# EasyEDA Pro project ProPrj_Embedded Tools_2024-11-02.epro, schematic X-Link&OSBDM

## Sheets
1 Misc: Board Name: X-Link&OSBDM; Create Date: 2024-08-30; Page Name: Misc; Project Name: Embedded Tools; Schematic Name: X-Link&OSBDM; Update Date: 2024-11-01; Company: 嘉立创EDA; Page Size: A4; Version: V1.0
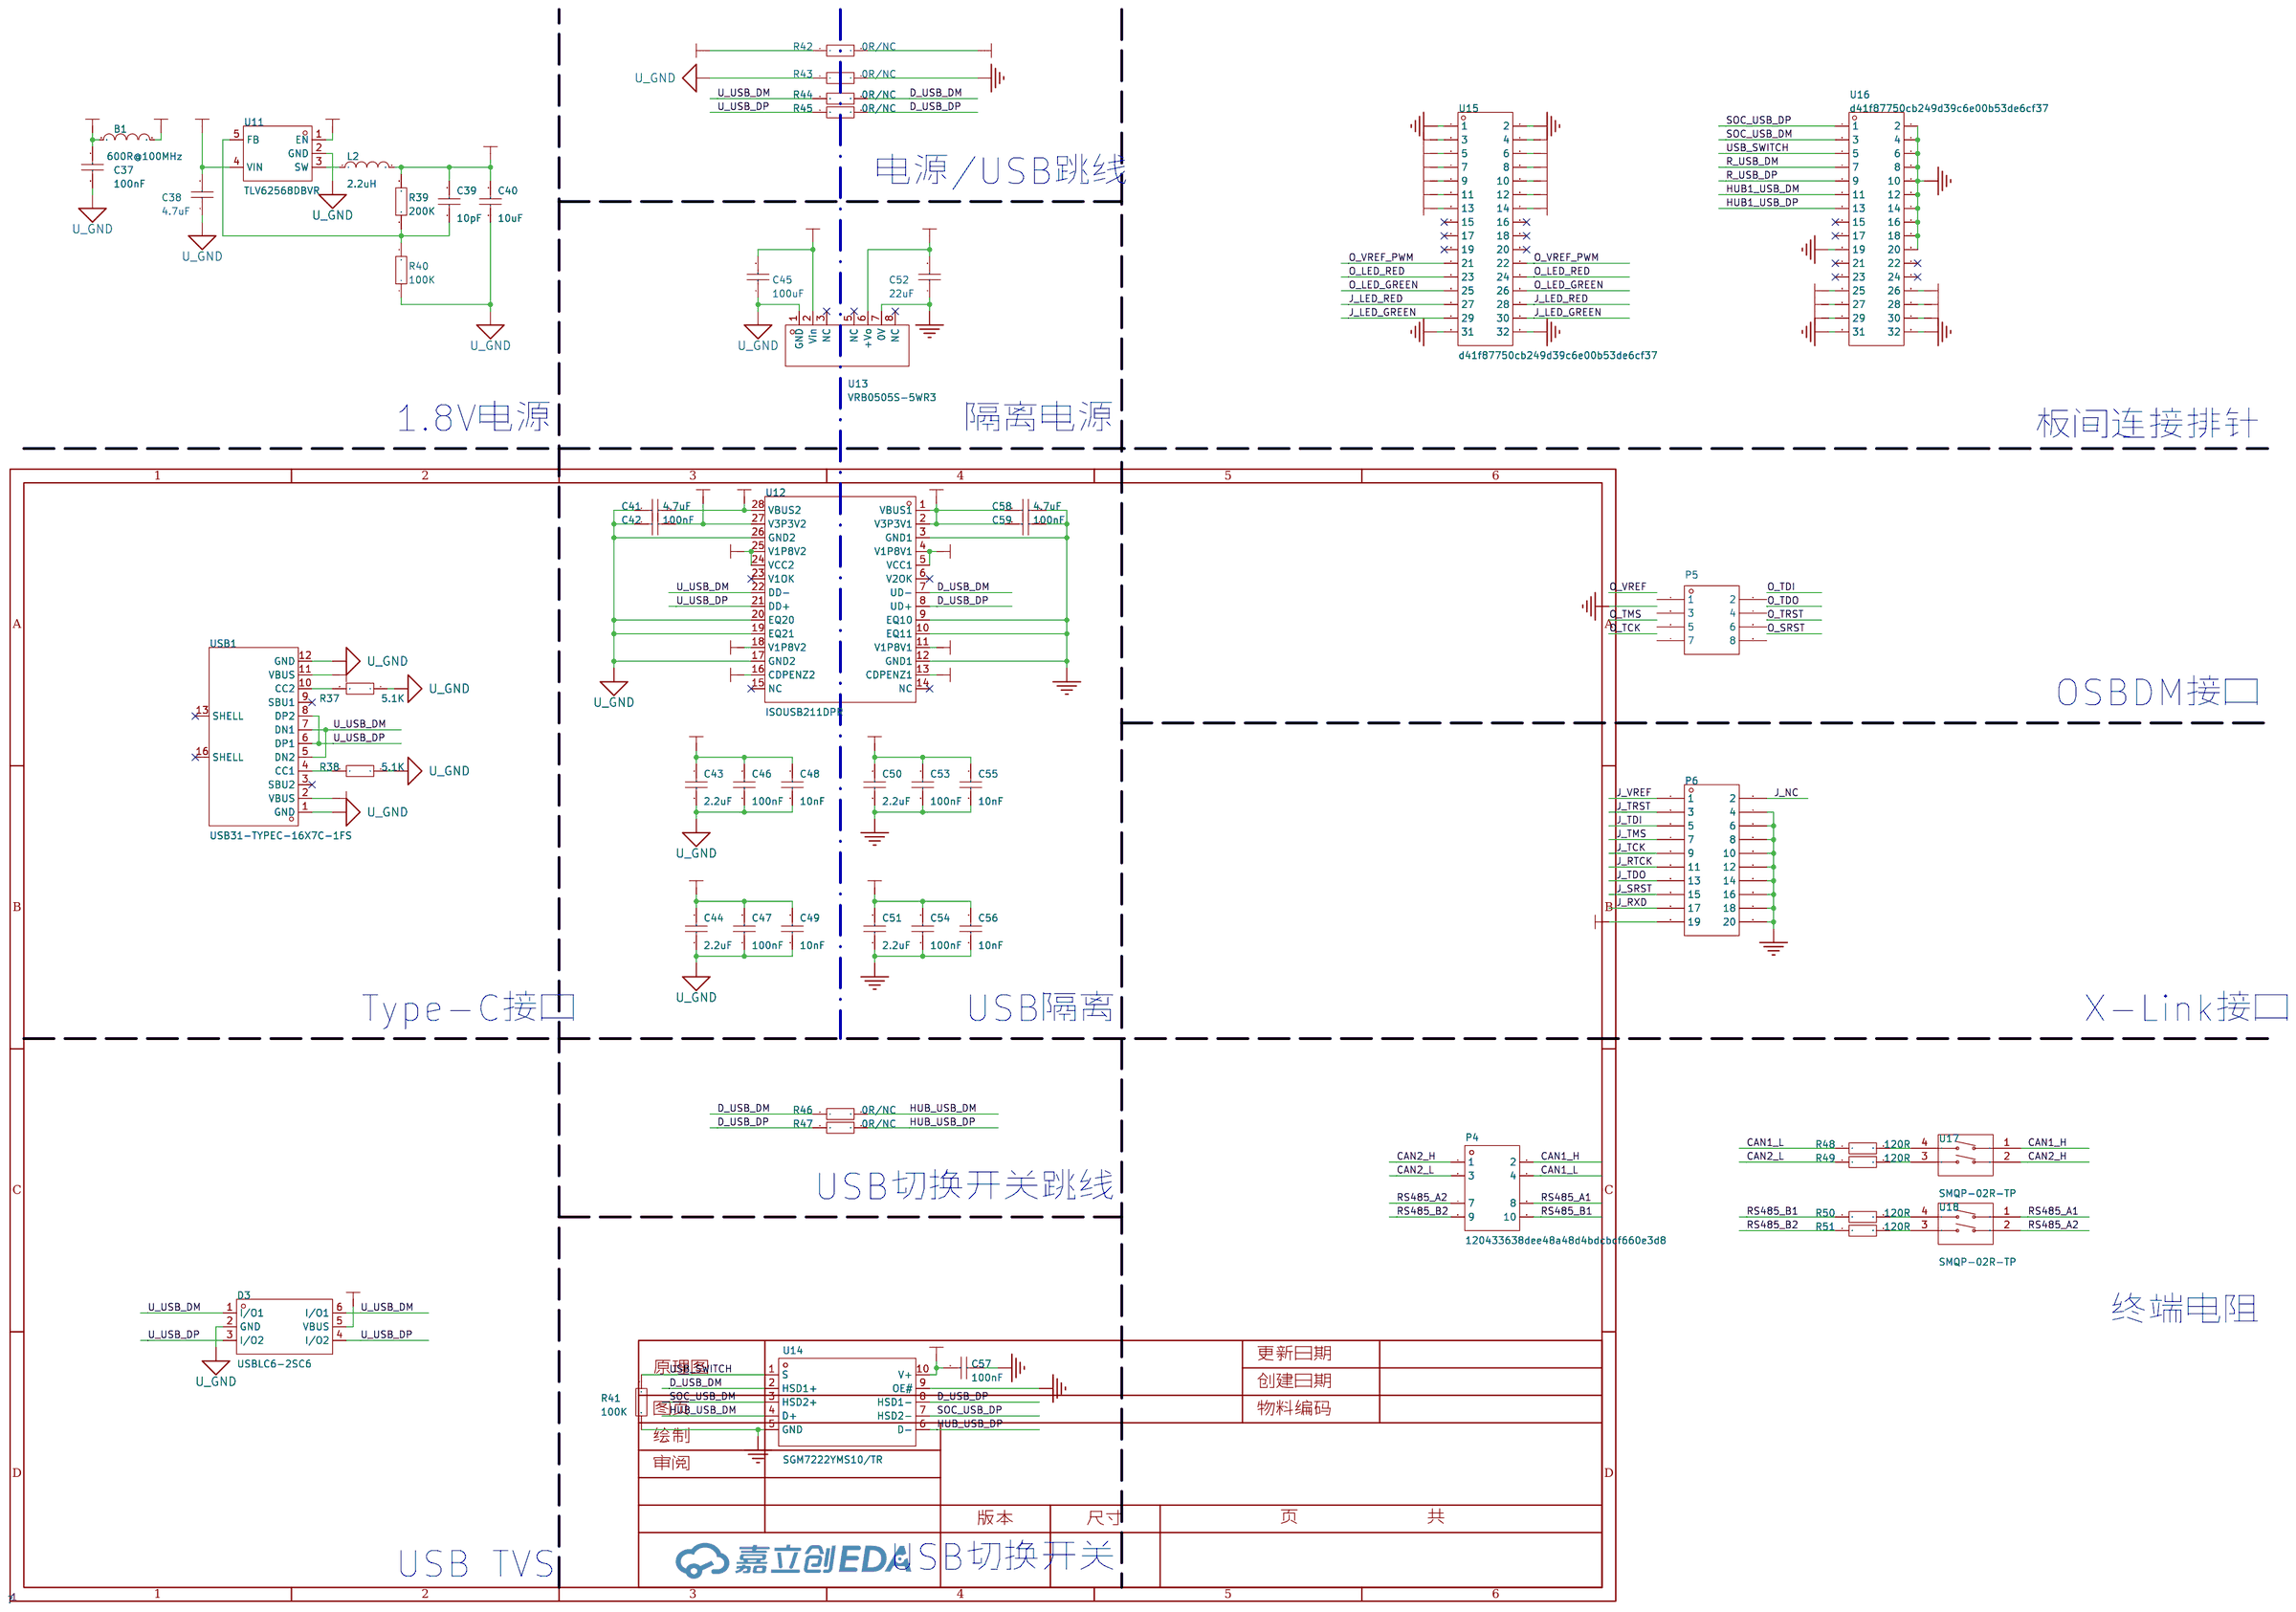
[diagram p5: Misc]
2 OSBDM: Create Date: 2024-09-08; Page Name: OSBDM; Update Date: 2024-10-13
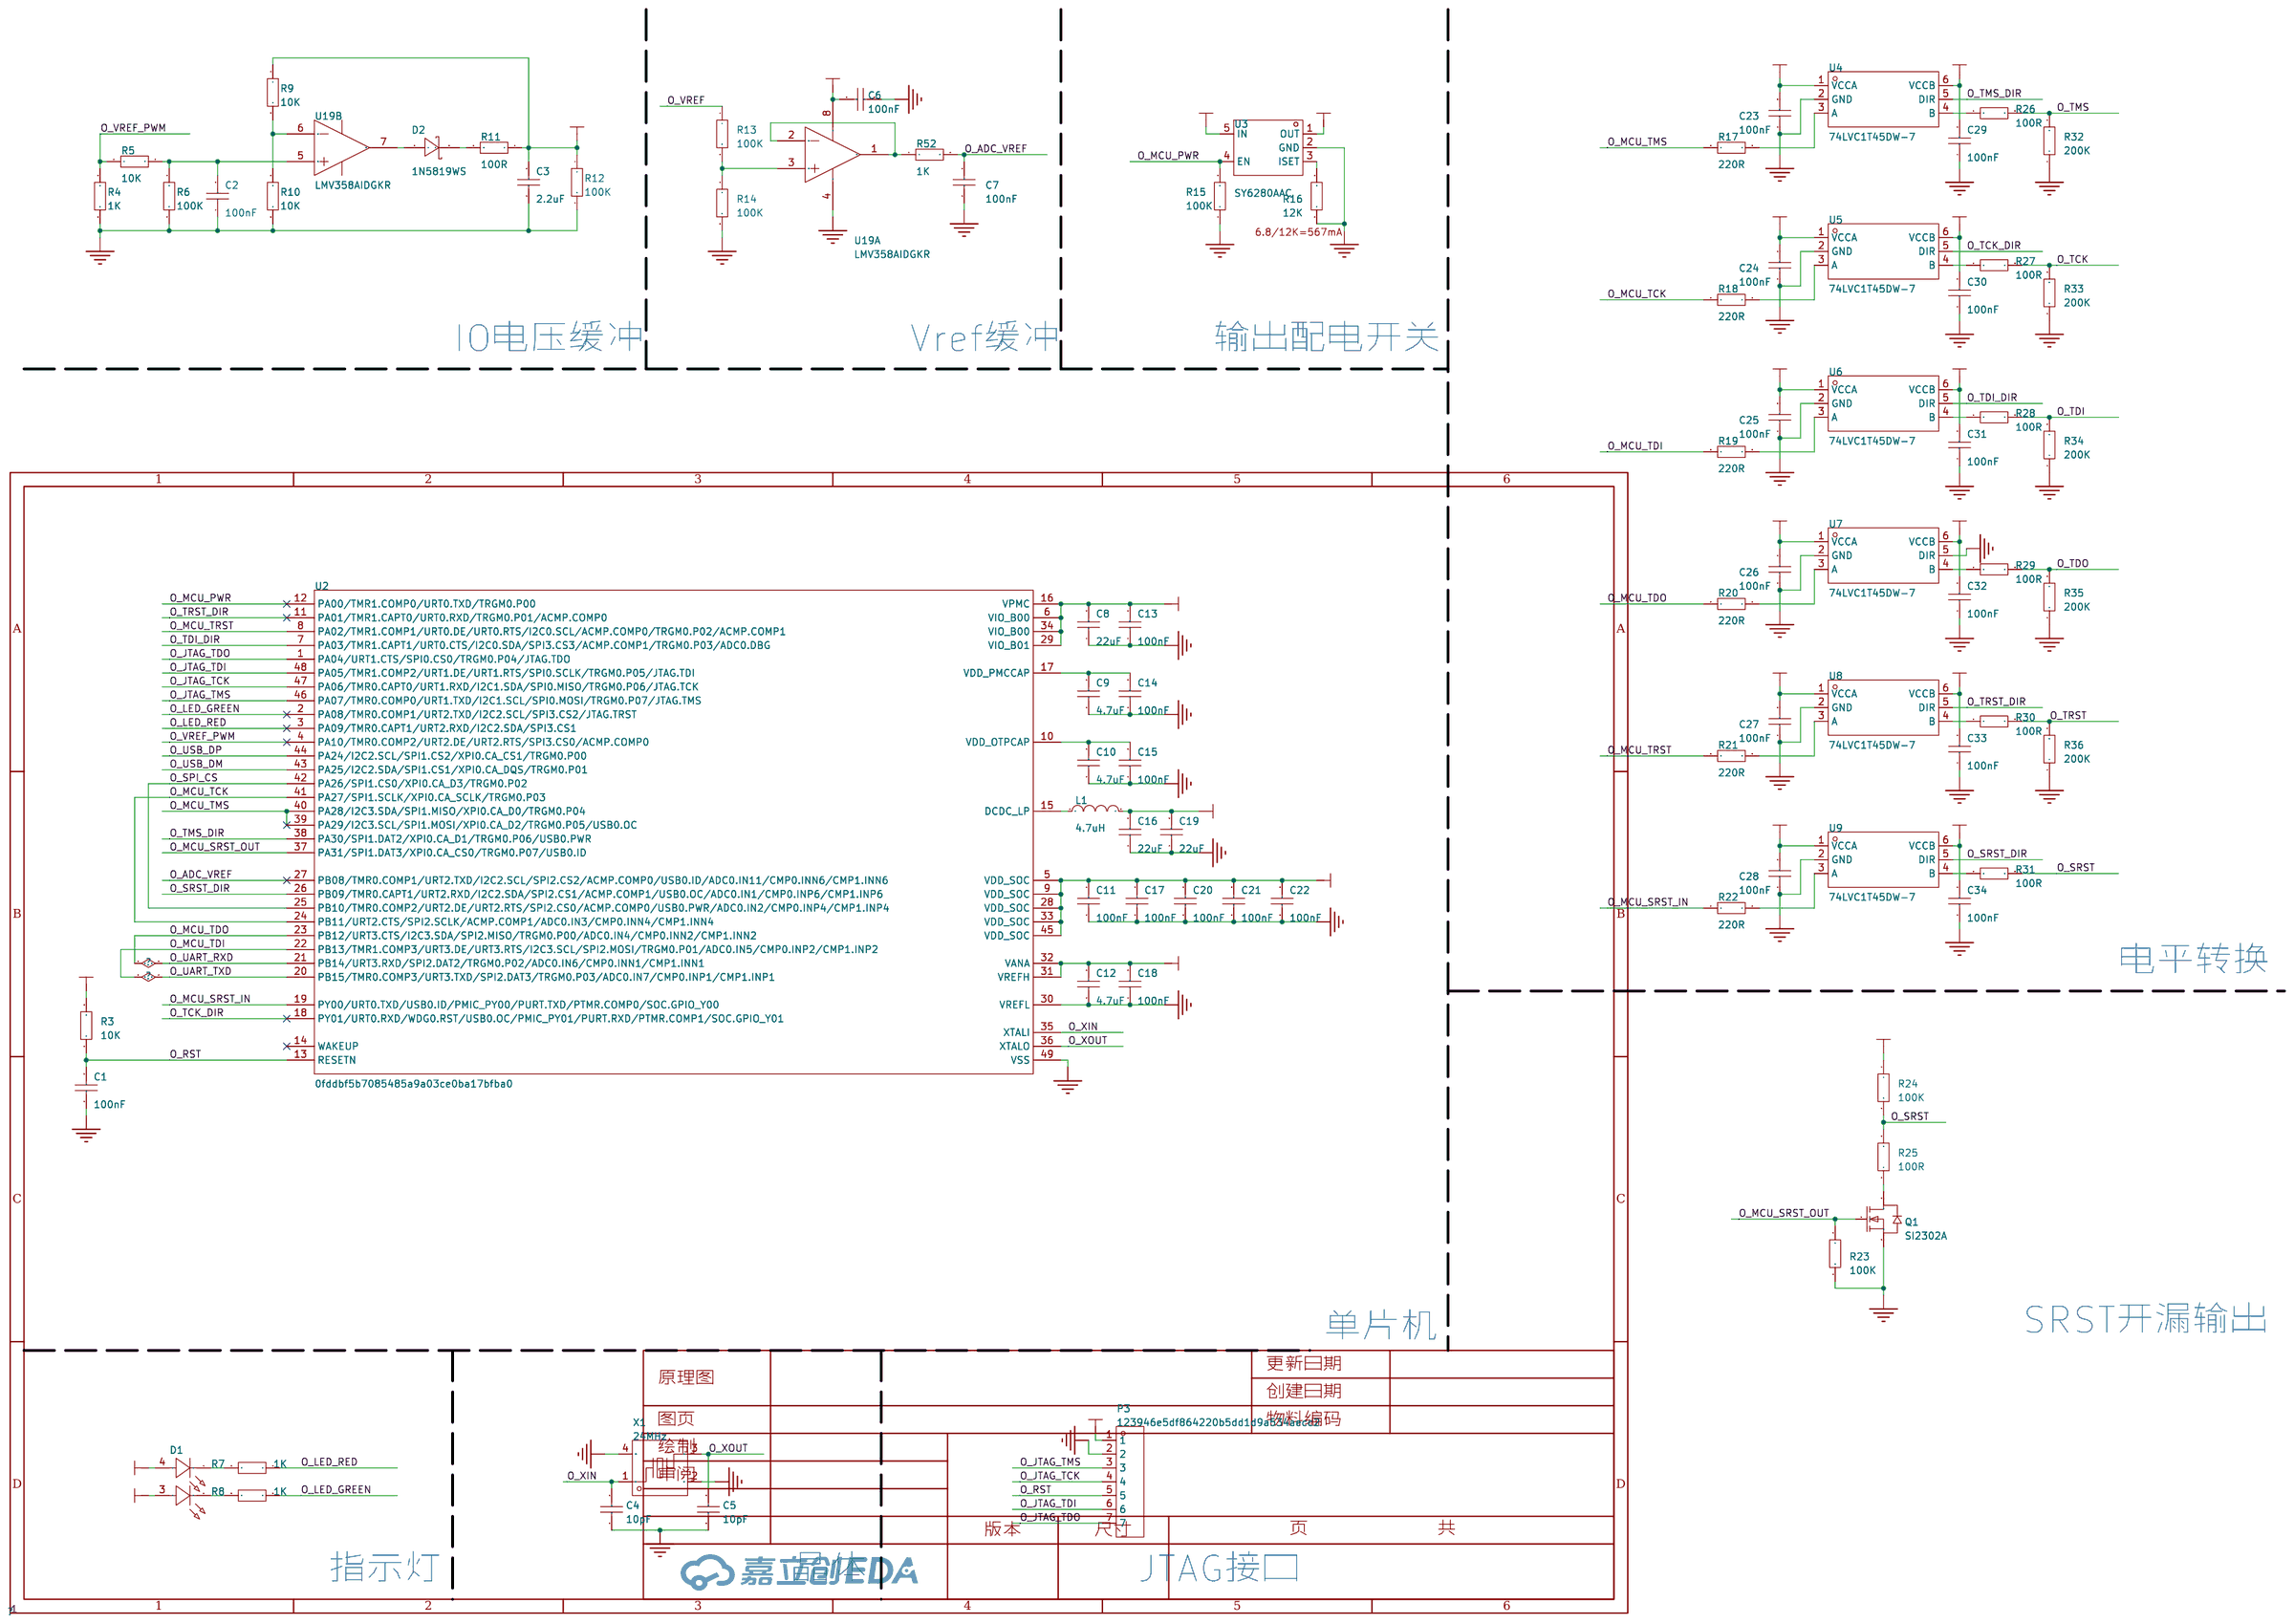
[diagram p6: OSBDM]
3 X-Link: Create Date: 2024-09-09; Page Name: X-Link; Update Date: 2024-10-02
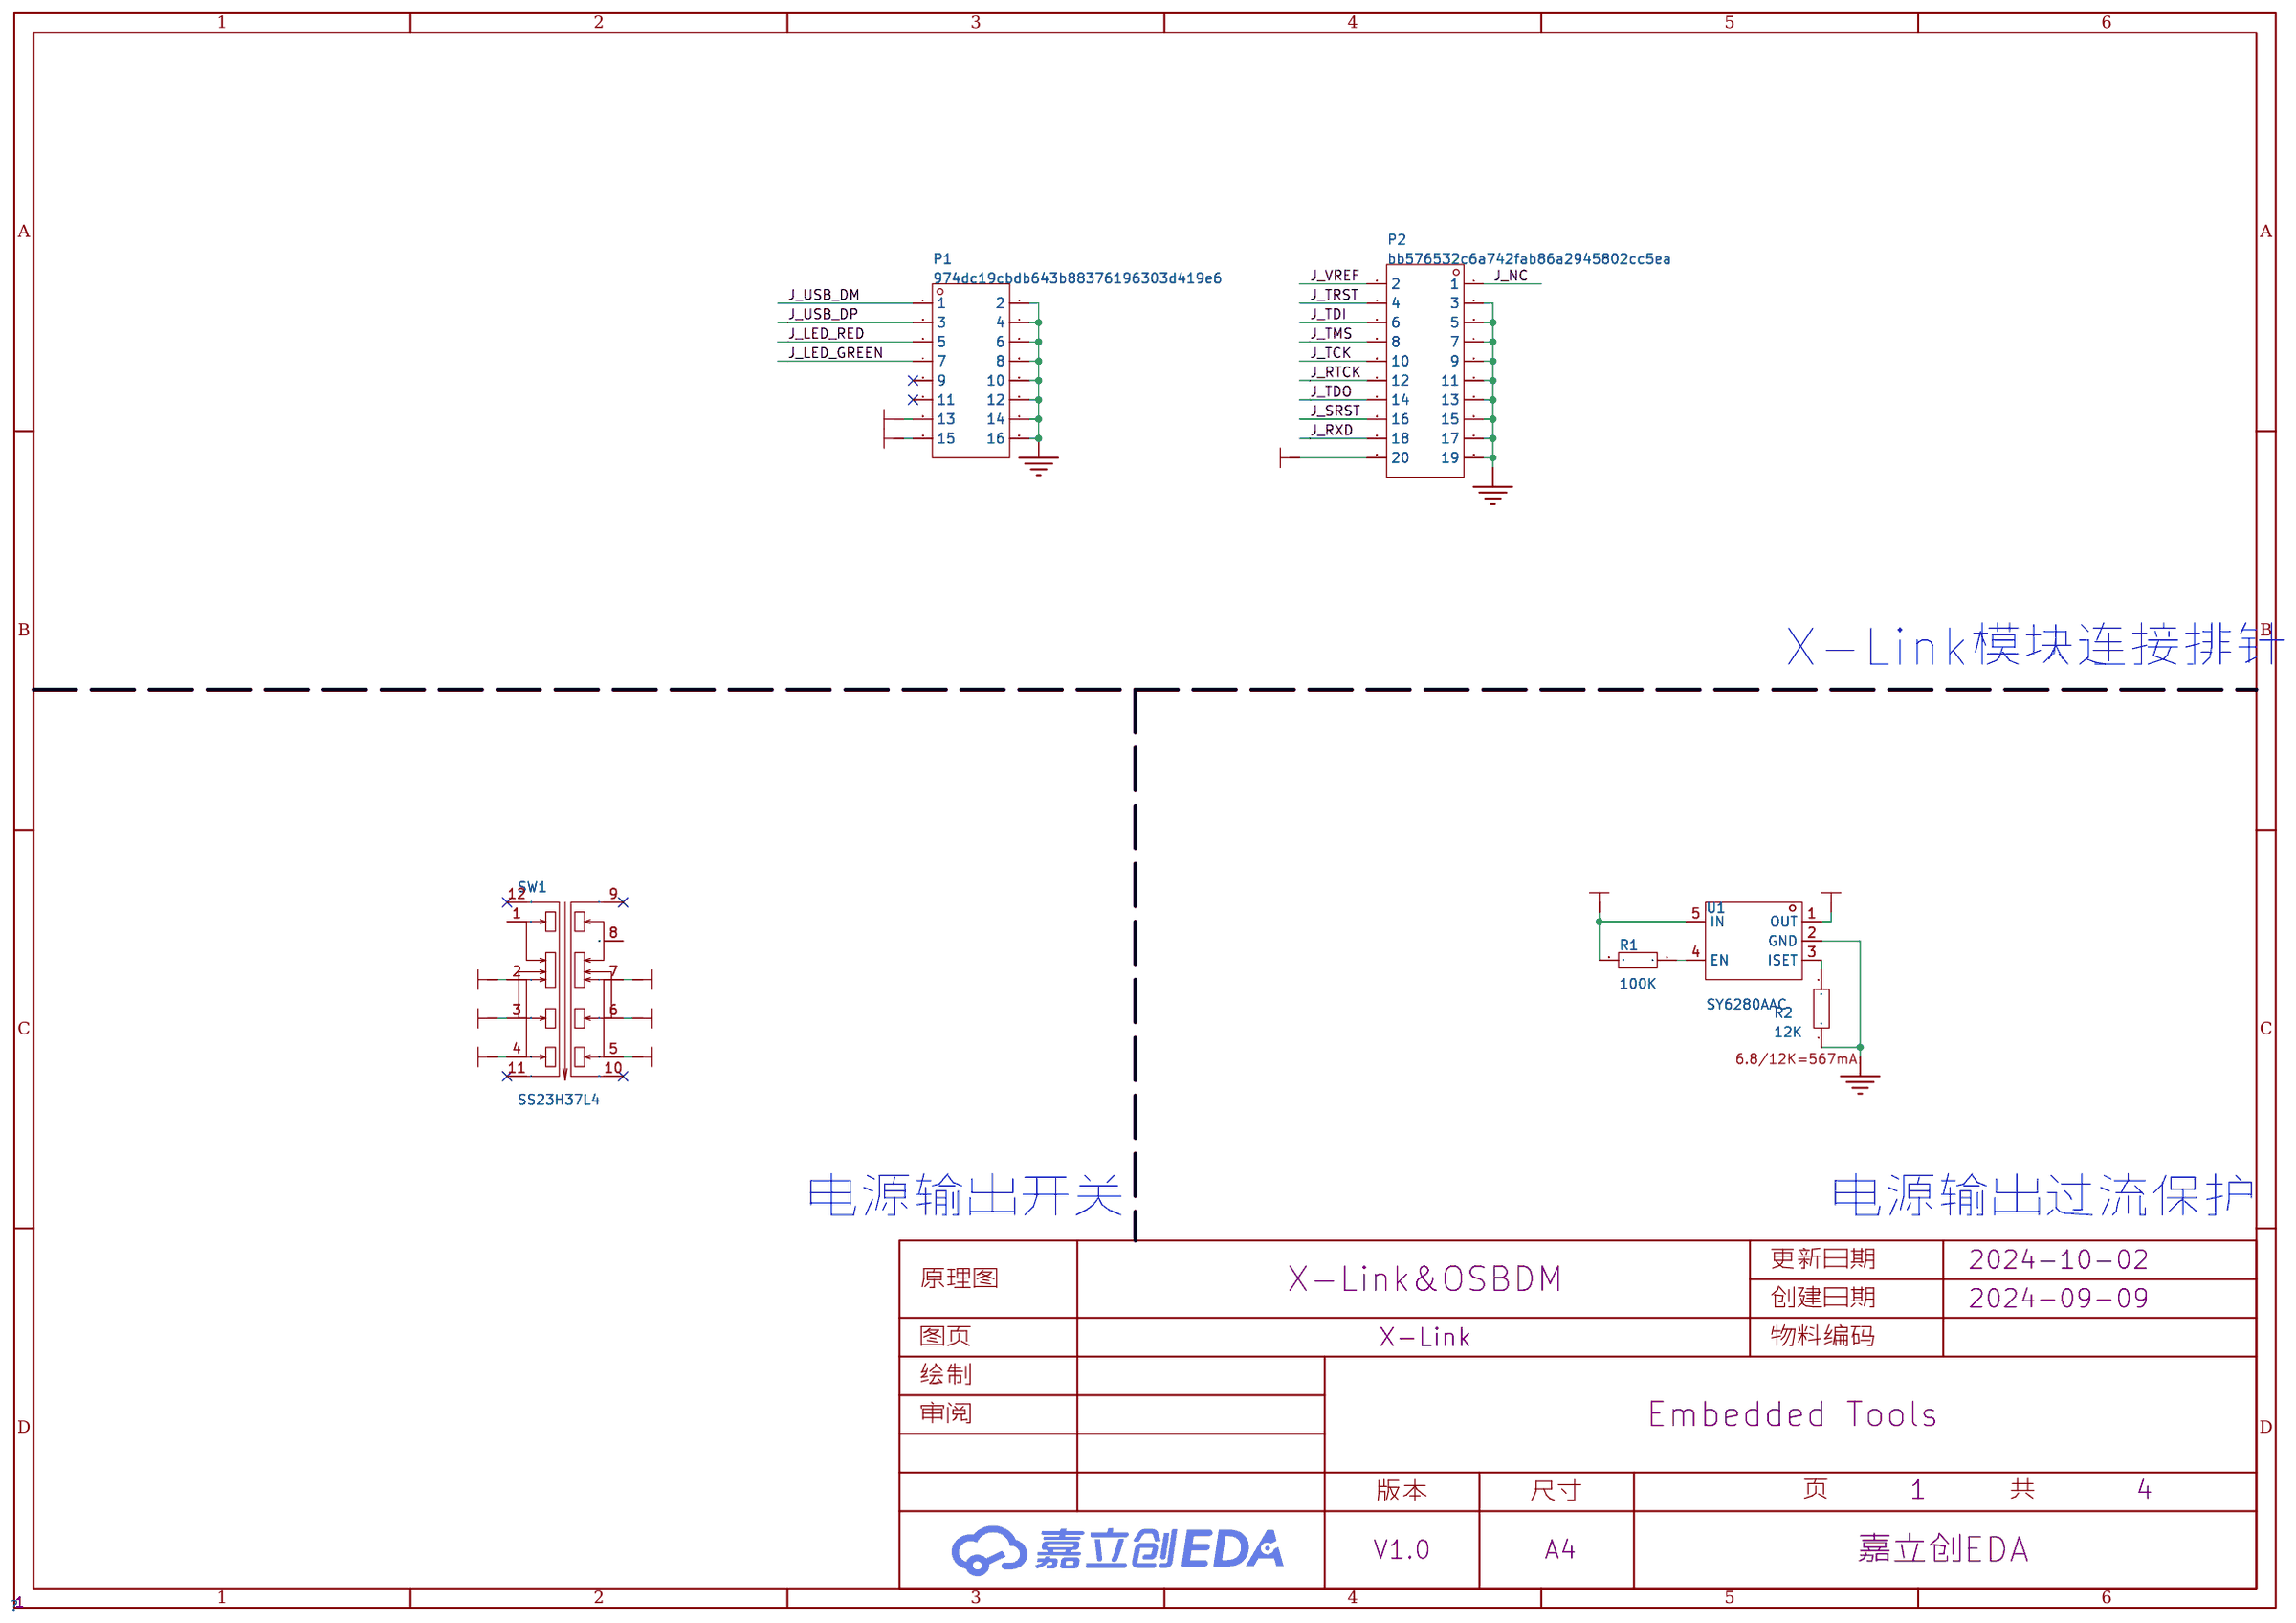
[diagram p7: X-Link]
4 USB_HUB: Create Date: 2024-09-16; Page Name: USB_HUB; Update Date: 2024-10-01
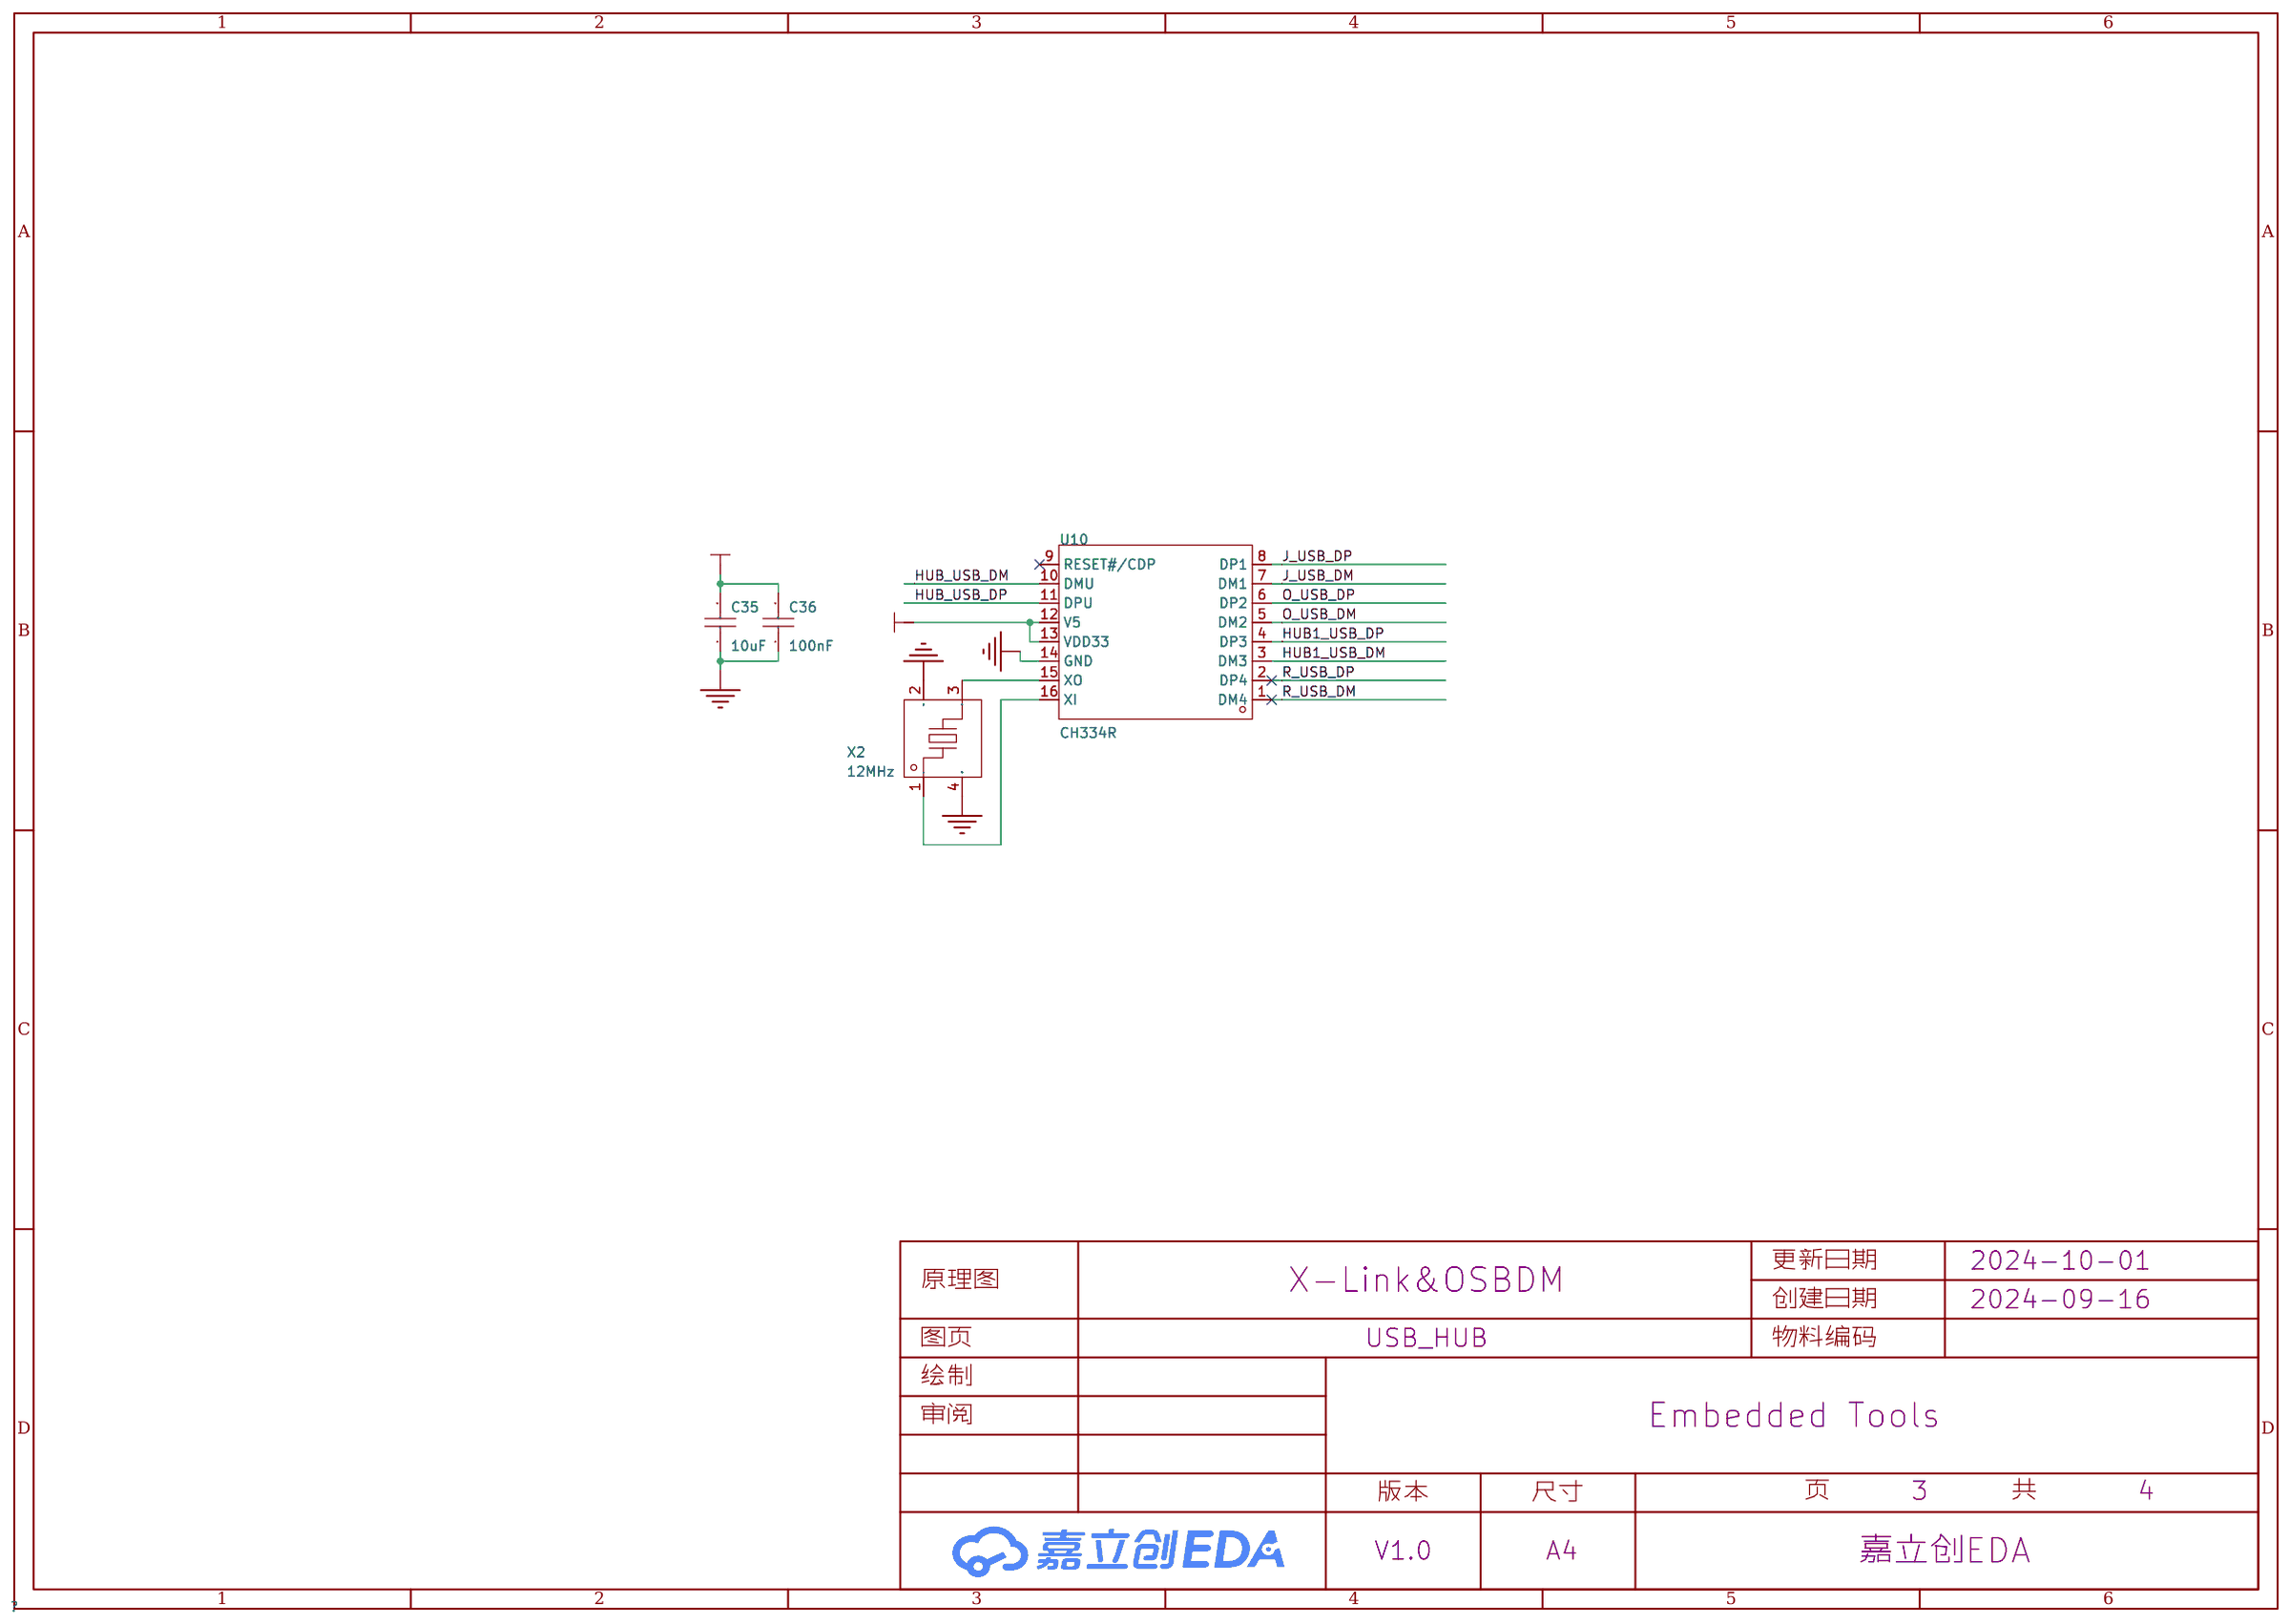
[diagram p8: USB_HUB]

## Parts
sheet Misc
B1  600R@100MHz  [L0603]
C37  100nF  [C0402]
C38  4.7uF  [C0402]
C39  10pF  [C0402]
C40  10uF  [C0402]
C41  4.7uF  [C0402]
C42  100nF  [C0402]
C43  2.2uF  [C0402]
C44  2.2uF  [C0402]
C45  100uF  [C1206]
C46  100nF  [C0402]
C47  100nF  [C0402]
C48  10nF  [C0402]
C49  10nF  [C0402]
C50  2.2uF  [C0402]
C51  2.2uF  [C0402]
C52  22uF  [C0603]
C53  100nF  [C0402]
C54  100nF  [C0402]
C55  10nF  [C0402]
C56  10nF  [C0402]
C57  100nF  [C0402]
C58  4.7uF  [C0402]
C59  100nF  [C0402]
D3  USBLC6-2SC6  [SOT-23-6_L2.9-W1.6-P0.95-LS2.8-BL]
L2  2.2uH  [IND-SMD_L2.5-W2.0_MHCHL2520]
P4  120433638dee48a48d4bdcbcf660e3d8  [HDR-TH_10P-P1.27-V-M-R2-C5-S1.27_1]
P5  -  [IDC-SMD_8P-P2.54]
P6  -  [IDC-SMD_20P-P2.54]
R37  5.1K  [R0402]
R38  5.1K  [R0402]
R39  200K  [R0402]
R40  100K  [R0402]
R41  100K  [R0402]
R42  0R/NC  [R1206]
R43  0R/NC  [R1206]
R44  0R/NC  [R1206]
R45  0R/NC  [R1206]
R46  0R/NC  [R0402]
R47  0R/NC  [R0402]
R48  120R  [R1206]
R49  120R  [R1206]
R50  120R  [R1206]
R51  120R  [R1206]
U11  TLV62568DBVR  [SOT-23-5_L3.0-W1.7-P0.95-LS2.8-BR]
U12  ISOUSB211DPR  [SSOP-28_L10.3-W7.5-P0.65-LS10.3-BL]
U13  VRB0505S-5WR3  [PWRM-TH_7P-L22.0-W9.5-P2.54_VRB0505S-5WR3_ST]
U14  SGM7222YMS10/TR  [MSOP-10_L3.0-W3.0-P0.50-LS5.0-BL]
U15  d41f87750cb249d39c6e00b53de6cf37  [HDR-TH_32P-P1.27-V-M-R2-C16-S1.27]
U16  d41f87750cb249d39c6e00b53de6cf37  [HDR-TH_32P-P1.27-V-M-R2-C16-S1.27]
U17  SMQP-02R-TP  [SW-TH_4P-P2.54_SMQP-02R-TP]
U18  SMQP-02R-TP  [SW-TH_4P-P2.54_SMQP-02R-TP]
USB1  USB31-TYPEC-16X7C-1FS  [USB-SMD_USB31-TYPEC-16X7C-1FS]
sheet OSBDM
C1  100nF  [C0402]
C2  100nF  [C0402]
C3  2.2uF  [C0402]
C4  10pF  [C0402]
C5  10pF  [C0402]
C6  100nF  [C0402]
C7  100nF  [C0402]
C8  22uF  [C0603]
C9  4.7uF  [C0402]
C10  4.7uF  [C0402]
C11  100nF  [C0402]
C12  4.7uF  [C0402]
C13  100nF  [C0402]
C14  100nF  [C0402]
C15  100nF  [C0402]
C16  22uF  [C0603]
C17  100nF  [C0402]
C18  100nF  [C0402]
C19  22uF  [C0603]
C20  100nF  [C0402]
C21  100nF  [C0402]
C22  100nF  [C0402]
C23  100nF  [C0402]
C24  100nF  [C0402]
C25  100nF  [C0402]
C26  100nF  [C0402]
C27  100nF  [C0402]
C28  100nF  [C0402]
C29  100nF  [C0402]
C30  100nF  [C0402]
C31  100nF  [C0402]
C32  100nF  [C0402]
C33  100nF  [C0402]
C34  100nF  [C0402]
D1  -  [LED1615]
D2  1N5819WS  [SOD-323_L1.8-W1.3-LS2.5-RD]
L1  4.7uH  [IND-SMD_L2.5-W2.0]
P3  123946e5df864220b5dd1d9a534aecc2  [HDR-TH_7P-P1.27-V-M-1]
Q1  SI2302A  [SOT-23-3_L2.9-W1.3-P1.90-LS2.4-BR]
R3  10K  [R0402]
R4  1K  [R0402]
R5  10K  [R0402]
R6  100K  [R0402]
R7  1K  [R0402]
R8  1K  [R0402]
R9  10K  [R0402]
R10  10K  [R0402]
R11  100R  [R0402]
R12  100K  [R0402]
R13  100K  [R0402]
R14  100K  [R0402]
R15  100K  [R0402]
R16  12K  [R0402]
R17  220R  [R0402]
R18  220R  [R0402]
R19  220R  [R0402]
R20  220R  [R0402]
R21  220R  [R0402]
R22  220R  [R0402]
R23  100K  [R0402]
R24  100K  [R0402]
R25  100R  [R0402]
R26  100R  [R0402]
R27  100R  [R0402]
R28  100R  [R0402]
R29  100R  [R0402]
R30  100R  [R0402]
R31  100R  [R0402]
R32  200K  [R0402]
R33  200K  [R0402]
R34  200K  [R0402]
R35  200K  [R0402]
R36  200K  [R0402]
R52  1K  [R0402]
U2  0fddbf5b7085485a9a03ce0ba17bfba0  [QFN-48_L6.0-W6.0-P0.4-BL-EP4.2]
U3  SY6280AAC  [SOT-23-5_L3.0-W1.7-P0.95-LS2.8-BL]
U4  74LVC1T45DW-7  [SC-70-6_L2.2-W1.3-P0.65-LS2.1-BR]
U5  74LVC1T45DW-7  [SC-70-6_L2.2-W1.3-P0.65-LS2.1-BR]
U6  74LVC1T45DW-7  [SC-70-6_L2.2-W1.3-P0.65-LS2.1-BR]
U7  74LVC1T45DW-7  [SC-70-6_L2.2-W1.3-P0.65-LS2.1-BR]
U8  74LVC1T45DW-7  [SC-70-6_L2.2-W1.3-P0.65-LS2.1-BR]
U9  74LVC1T45DW-7  [SC-70-6_L2.2-W1.3-P0.65-LS2.1-BR]
U19  LMV358AIDGKR  [VSSOP-8_L3.0-W3.0-P0.65-LS5.0-BL]  (sections 1,2)
X1  24MHz  [CRYSTAL-SMD_4P-L2.0-W1.6-BL-A]
sheet USB_HUB
C35  10uF  [C0402]
C36  100nF  [C0402]
U10  CH334R  [QSOP-16_L4.9-W3.9-P0.64-LS6.0-BL]
X2  12MHz  [CRYSTAL-SMD_4P-L2.5-W2.0-BL-A]
sheet X-Link
P1  974dc19cbdb643b88376196303d419e6  [HDR-SMD_16P-P1.27-V-M-R2-C8-LS5.5]
P2  bb576532c6a742fab86a2945802cc5ea  [HDR-SMD_20P-P1.27-V-M-R2-C10-LS5.5]
R1  100K  [R0402]
R2  12K  [R0402]
SW1  SS23H37L4  [SW-TH_SS23H37LX_SMD]
U1  SY6280AAC  [SOT-23-5_L3.0-W1.7-P0.95-LS2.8-BL]

## Library data of the parts
B1 = B0603
C1-C7 C9-C15 C17 C18 C20-C44 C46-C51 C53-C59 = C0402
C45 = C1206
C8 C16 C19 C52 = C0603
D3 = USBLC6-2SC6: 最大钳位电压:15V;击穿电压:6V;; Supplier Part: C2687116; Manufacturer: UMW(友台半导体); Supplier Footprint: SOT-23-6; JLCPCB Part Class: 扩展库; Datasheet: https://atta.szlcsc.com/upload/public/pdf/source/20231109/512642D850D9873E7C519F71E85B9A10.pdf; Supplier: LCSC; Maximum Clamping Voltage: 15V; Breakdown Voltage: 6V; Number of Lines: 双路; Type: ESD
L2 = FTC252012S2R2MBCA: 电感值:2.2uH;精度:±20%;额定电流:3A;饱和电流(Isat):3.8A;类型:一体成型电感;; LCSC Part Name: 2.2uH ±20% 3.8A; Supplier Part: C5832372; Manufacturer: cjiang(长江微电); Supplier Footprint: 1008; JLCPCB Part Class: 扩展库; Datasheet: https://atta.szlcsc.com/upload/public/pdf/source/20230602/8FFEDA9C0247A92A0D4B67554BFE4091.pdf; Supplier: LCSC; Tolerance: ±20%; Rated Current: 3A; Saturation Current (Isat): 3.8A; DC Resistance (DCR): 55mΩ; Type: 一体成型电感
P4 = HDR2x5_1.27_1: Pin Structure: 2x5P; Pitch: 1.27mm; Row Spacing: 1.27mm; Circluar Pins/Square Pins: 方针; Mounting Type: 直插; Number of Rows: 双排; Number of Pins: 5P; Current Rating (Max): 1A; Voltage Rating (Max): 500V; Length of Mating Pin: 3.9mm; Insulation Height: 1mm; Length of End Connection Pin: 2.3mm; Contact Material: 黄铜; Contact Plating: 金; Operating Temperature Range: -40℃~+105℃; Color: 黑色
P5 = IDC2x4_SMD: LCSC Part Name: 2.54mm 2x4P 直插; Supplier Footprint: 插件,P=2.54mm; Pitch: 2.54mm; Number of Pins: 8; Number of Rows: 2; Pin Structure: 2x4P; Row Spacing: 2.54mm; Mounting Type: 直插; Length of Mating Pin: 6mm; Insulation Height: 2.54mm; Length of End Connection Pin: 3mm; Contact Material: 黄铜; Operating Temperature Range: -40℃~+105℃; Color: 黑色
P6 = IDC2x10_SMD: LCSC Part Name: 2.54mm 2x10P 直插; Supplier Footprint: 插件,P=2.54mm; JLCPCB Part Class: 扩展库; Pitch: 2.54mm; Number of Pins: 20; Number of Rows: 2; Pin Structure: 2x10P; Row Spacing: 2.54mm; Mounting Type: 直插; Length of Mating Pin: 6mm; Insulation Height: 2.54mm; Length of End Connection Pin: 3mm; Contact Material: 黄铜; Operating Temperature Range: -40℃~+105℃; Color: 黑色
R1-R41 R46 R47 R52 = R0402
R42-R45 R48-R51 = R1206: Tolerance: ±1%; Power(Watts): 250mW; Overload Voltage (Max): 200V
U11 = TLV62568DBVR: 功能类型:降压型;输出类型:可调;输入电压:2.5V~5.5V;输出电压:600mV~5.5V;输出电流(最大值):1A;; Supplier Part: C163219; Manufacturer: TI(德州仪器); Supplier Footprint: SOT-23-5; JLCPCB Part Class: 扩展库; Datasheet: https://www.ti.com/cn/lit/gpn/tlv62568; Supplier: LCSC; Function: 降压型; Output Type: 可调; Input Voltage: 2.5V~5.5V; Output Voltage: 600mV~5.5V; Output Current (Max): 1A; Switching Frequency: 1.5MHz; Operating Temperature: -40℃~+125℃@(TJ); Synchronous Rectification: 是; Number of Outputs: 1; Topology: 降压式; Switch tube (built-in/external): 内置
U12 = ISOUSB211DPR: ISOUSB211 支持低速、高速和全速的低发射隔离式 USB 中继器; Supplier Part: C5772877; Manufacturer: TI(德州仪器); Supplier Footprint: BSSOP-28-300mil; JLCPCB Part Class: 扩展库; Datasheet: https://atta.szlcsc.com/upload/public/pdf/source/20230925/C201D485FB1E1EBF3CEDEE9AEF66BD61.pdf; Supplier: LCSC
U13 = VRB0505S-5WR3_ST: Supplier Part: C5189717; Manufacturer: MORNSUN(金升阳); Supplier Footprint: SIP-7; Datasheet: https://atta.szlcsc.com/upload/public/pdf/source/20230425/EEAB300A3CA35F3087473504672B5381.pdf; Supplier: LCSC
U14 = SGM7222YMS10/TR: 开关电路:-;多路复用器/解复用器电路:-;导通电阻（最大值）:-;开关电压（最大值）:-;; Supplier Part: C113292; Manufacturer: SGMICRO(圣邦微); Supplier Footprint: MSOP-10; JLCPCB Part Class: Extended Part; Datasheet: https://atta.szlcsc.com/upload/public/pdf/source/20170712/C113292_1499832269144814226.pdf; Supplier: LCSC
U15 U16 = HDR2x16_1.27: Datasheet: https://atta.szlcsc.com/upload/public/pdf/source/20230512/C02704E0D5277BE7490B80240C3912B9.pdf; Pin Structure: 2x16P; Pitch: 1.27mm; Row Spacing: 1.27mm; Circluar Pins/Square Pins: 方针; Mounting Type: 直插; Number of Rows: 双排; Number of Pins: 32P; Current Rating (Max): 1A; Voltage Rating (Max): 250V; Length of Mating Pin: 4mm; Insulation Height: 1mm; Length of End Connection Pin: 2.3mm; Contact Material: 黄铜; Contact Plating: 金; Operating Temperature Range: -40℃~+105℃; Soldering Temperature(Max): 260℃; Color: 黑色
U17 U18 = SMQP-02R-TP: 类型:琴键;电路结构:-;开关位数:2位;额定电流:-;额定电压:-;使用寿命:5千次;颜色:红色;; LCSC Part Name: 间距2.54mm 琴键2位拨码开关; Supplier Part: C5299482; Manufacturer: SM Switch; JLCPCB Part Class: 扩展库; Datasheet: https://atta.szlcsc.com/upload/public/pdf/source/20230428/70B55ED7BA6FDEB5D2D5B22165FF4512.pdf; Supplier: LCSC; Type: 琴键; Number of Positions: 2位; Lead Pitch: 2.54mm; Operating Temperature: -40℃~+85℃; Operating Life: 5千次; Color: 红色
USB1 = USB31-TYPEC-16X7C-1FS: 连接器类型:Type-C;标准:USB 3.1;公母:母;安装方式:沉板;触点数量:24P;端口数量:1;额定电流 - 电源:3A;触头材质:磷青铜;触头镀层:金;工作温度范围:-25℃~+80℃;焊接温度(最大值):260℃;; LCSC Part Name: Type-C 母 沉板 两件套; Supplier Part: C2880667; Manufacturer: XKB Connection(中国星坤); Supplier Footprint: SMD; JLCPCB Part Class: 扩展库; Datasheet: https://atta.szlcsc.com/upload/public/pdf/source/20211011/8558E12E1491007827A313C13D78E73E.pdf; Supplier: LCSC; Connector Type: Type-C; Standard: USB 3.1; Gender: 母; Mounting Style: 沉板; Number of Contacts: 24P; Number of Ports: 1; Current Rating - Power (Max): 3A; Contact Material: 磷青铜; Contact Plating: 金; Operating Temperature Range: -25℃~+80℃; Soldering Temperature(Max): 260℃
D1 = LED1615
D2 = 1N5819WS_C191023: 直流反向耐压(Vr):40V;平均整流电流(Io):1A;正向压降(Vf):600mV@1A;; LCSC Part Name: 40V 1A 600mV@1A; Supplier Part: C191023; Manufacturer: Hottech(合科泰); Supplier Footprint: SOD-323; JLCPCB Part Class: 基础库; Datasheet: https://atta.szlcsc.com/upload/public/pdf/source/20220428/3CB86FD8D28D653594B4E35F9D5AEFD9.pdf; Supplier: LCSC; Reverse Voltage (Vr): 40V; Average Rectified Current (Io): 1A; Forward Voltage (Vf@If): 600mV@1A
L1 = SWPA252012S4R7MT: 电感值:4.7uH;精度:±20%;额定电流:840mA;饱和电流(Isat):1.25A;类型:-;; LCSC Part Name: 4.7uH ±20% 1.25A; Supplier Part: C87640; Manufacturer: Sunlord(顺络); Supplier Footprint: 1008; JLCPCB Part Class: 扩展库; Datasheet: https://atta.szlcsc.com/upload/public/pdf/source/20231024/317626D2AA2F8AB4113C1875E432E6E1.pdf; Supplier: LCSC; Tolerance: ±20%; Rated Current: 840mA; Saturation Current (Isat): 1.25A; DC Resistance (DCR): 377mΩ
P3 = HDR1x7_1.27: LCSC Part Name: 间距:1.27mm 1x7P 直插 方针; Supplier Footprint: 插件,P=1.27mm; Pin Structure: 1x7P; Pitch: 1.27mm; Circluar Pins/Square Pins: 方针; Mounting Type: 直插; Number of Rows: 单排; Number of Pins: 7P; Current Rating (Max): 1A; Length of Mating Pin: 3mm; Insulation Height: 1mm; Length of End Connection Pin: 2.5mm
Q1 = SI2302A: 类型:N沟道;漏源电压(Vdss):20V;连续漏极电流(Id):2.8A;功率(Pd):1.25W;导通电阻(RDS(on)@Vgs,Id):115mΩ@2.5V,3.1A;阈值电压(Vgs(th)@Id):1.9V@250uA;; LCSC Part Name: N沟道 耐压:20V 电流:2.8A; Supplier Part: C347483; Manufacturer: UMW(友台半导体); Supplier Footprint: SOT-23; JLCPCB Part Class: 扩展库; Datasheet: https://atta.szlcsc.com/upload/public/pdf/source/20231109/A05513FBA15B68C9BEB83ADF1A9CDC8E.pdf; Supplier: LCSC; Type: N沟道; Drain Source Voltage (Vdss): 20V; Continuous Drain Current (Id): 2.8A; Power Dissipation (Pd): 1.25W; Drain Source On Resistance (RDS(on)@Vgs,Id): 115mΩ@2.5V,3.1A; Gate Threshold Voltage (Vgs(th)@Id): 1.9V@250uA; Total Gate Charge (Qg@Vgs): 10nC@4.5V; Input Capacitance (Ciss@Vds): 300pF@10V
U2 = HPM5301IEG1
U1 U3 = SY6280AAC_C55136: 低能耗配电开关; Supplier Part: C55136; Manufacturer: silergy(矽力杰); Supplier Footprint: SOT-23-5; JLCPCB Part Class: 扩展库; Datasheet: https://atta.szlcsc.com/upload/public/pdf/source/20161108/1478586372822.pdf; Supplier: LCSC
U4-U9 = 74LVC1T45DW-7: 电压(VCCA):1.65V~5.5V;电压(VCCB):1.65V~5.5V;电路数:1;每个电路通道数:1;; Supplier Part: C168855; Manufacturer: DIODES(美台); Supplier Footprint: SC-70-6(SOT-363); JLCPCB Part Class: 扩展库; Datasheet: https://atta.szlcsc.com/upload/public/pdf/source/20180109/C168856_15154706151821250215.pdf; Supplier: LCSC; Channel Type: 双向; Supply Voltage (VCCA): 1.65V~5.5V; Supply Voltage (VCCB): 1.65V~5.5V; Number of Circuits: 1; Channels per Circuit: 1; Output Type: 非反相；三态; Operating Temperature: -40℃~+125℃
U19 = LMV358AIDGKR: 放大器数:双路;增益带宽积(GBP):1MHz;输入偏置电流(Ib):10pA;压摆率(SR):1.7V/us;带宽(-3db):-;轨到轨:-;; Supplier Part: C408974; Manufacturer: TI(德州仪器); Supplier Footprint: VSSOP-8; Datasheet: https://www.ti.com/cn/lit/gpn/lmv358a; Supplier: LCSC; Number of Circuits: 双路; Gain Bandwidth Product(GBP): 1MHz; Current - Input Bias(Ib): 10pA; Slew Rate(SR): 1.7V/us; Output Current: 40mA; Operating Temperature: -40℃~+125℃
X1 = XTAL2016
U10 = CH334R: Supplier Part: C4154405; Manufacturer: WCH(南京沁恒); Supplier Footprint: QSOP-16-150mil; JLCPCB Part Class: 扩展库; Datasheet: https://atta.szlcsc.com/upload/public/pdf/source/20240313/F70B229B132CE2CA6E618A7ACAF406E8.pdf; Supplier: LCSC
X2 = XTAL2520
P1 = HDR2x8_1.27_SMD: 插针结构:2x8P;间距:1.27mm;圆针/方针:方针;安装类型:立贴;排数:双排;总PIN位数:16P;额定电流:1A;配合针长度:4mm;塑高:1mm;工作温度范围:-40℃~+105℃;颜色:黑色;; LCSC Part Name: 2x8P 间距:1.27mm 立贴 方针; Supplier Footprint: SMD,P=1.27mm; JLCPCB Part Class: 扩展库; Datasheet: https://atta.szlcsc.com/upload/public/pdf/source/20231121/132ADD8FE50D9D5F7A5EBF788BB0A2C5.pdf; Pin Structure: 2x8P; Pitch: 1.27mm; Circluar Pins/Square Pins: 方针; Mounting Type: 立贴; Number of Rows: 双排; Number of Pins: 16P; Current Rating (Max): 1A; Length of Mating Pin: 4mm; Insulation Height: 1mm; Operating Temperature Range: -40℃~+105℃; Color: 黑色
P2 = HDR2x10_1.27_SMD: 插针结构:2x10P;间距:1.27mm;行距:1.27mm;圆针/方针:方针;安装类型:立贴;排数:双排;总PIN位数:20P;额定电流:1A;配合针长度:4mm;塑高:1.5mm;端接针长度:-;触头材质:黄铜;工作温度范围:-40℃~+105℃;焊接温度(最大值):260℃@10S;颜色:黑色;; LCSC Part Name: 2x10P 间距:1.27mm 方针 立贴; Supplier Footprint: SMD,P=1.27mm; JLCPCB Part Class: 扩展库; Datasheet: https://atta.szlcsc.com/upload/public/pdf/source/20230609/2ACB07ADC7D4DAF6D292F3D23C037F6C.pdf; Pin Structure: 2x10P; Pitch: 1.27mm; Row Spacing: 1.27mm; Circluar Pins/Square Pins: 方针; Mounting Type: 立贴; Number of Rows: 双排; Number of Pins: 20P; Current Rating (Max): 1A; Length of Mating Pin: 4mm; Insulation Height: 1.5mm; Contact Material: 黄铜; Operating Temperature Range: -40℃~+105℃; Soldering Temperature(Max): 260℃@10S; Color: 黑色
SW1 = SS23H37L4_SMD: 电路结构:双刀三掷;安装方式:直插;开关颜色:黑色;额定电流(DC):300mA;额定电压(DC):50V;额定电流(AC):300mA;额定电压(AC):50V;机械寿命:1万次;; Supplier: LCSC; Supplier Part: C883268; Manufacturer: XKB Connectivity(中国星坤); LCSC Part Name: 柄长4mm 直插三档 滑动开关; Supplier Footprint: 插件; Datasheet: https://atta.szlcsc.com/upload/public/pdf/source/20211011/B42684107FED9ECA6747C430E689FA80.pdf; Circuit: 双刀三掷; Actuator Style: 矩形柱状; Pin Style: PC引脚; Switch Length: 19.5mm; Switch Width: 6.6mm; Switch Height: 8mm; Mounting Style: 直插; Actuator Color: 黑色; Current Rating (DC): 300mA; Voltage Rating (DC): 50V; Current Rating (AC): 300mA; Voltage Rating (AC): 50V; Mechanical Life: 1万次; Operating Temperature: -40℃~+85℃

## Nets
3.3V: C35.2 C36.2 C57.2 U10.12(V5) U10.13(VDD33) U14.10(V+) U15.5 U15.6
5V: C52.2 R42.2 U13.6(+Vo) U15.3 U15.4
GND: C1.1 C2.1 C3.1 C4.1 C5.1 C6.2 C7.1 C8.1 C9.1 C10.1 C11.1 C12.1 C13.1 C14.1 C15.1 C16.1 C17.1 C18.1 C19.1 C20.1 C21.1 C22.1 C23.1 C24.1 C25.1 C26.1 C27.1 C28.1 C29.1 C30.1 C31.1 C32.1 C33.1 C34.1 C35.1 C36.1 C50.2 C51.2 C52.1 C53.2 C54.2 C55.2 C56.2 C57.1 C58.1 C59.1 P1.2 P1.4 P1.6 P1.8 P1.10 P1.12 P1.14 P1.16 P2.3 P2.5 P2.7 P2.9 P2.11 P2.13 P2.15 P2.17 P2.19 P3.2 P6.4 P6.6 P6.8 P6.10 P6.12 P6.14 P6.16 P6.18 P6.20 Q1.2(S) R2.1 R4.2 R6.2 R10.2 R12.2 R14.2 R15.1 R16.1 R23.2 R32.1 R33.1 R34.1 R35.1 R36.1 R41.2 R43.2 U1.2(GND) U2.30(VREFL) U2.49(VSS) U3.2(GND) U4.2(GND) U5.2(GND) U6.2(GND) U7.2(GND) U7.5(DIR) U8.2(GND) U9.2(GND) U10.14(GND) U12.3(GND1) U12.9(EQ10) U12.10(EQ11) U12.12(GND1) U13.7(0V) U14.5(GND) U14.9(OE#) U15.1 U15.2 U15.31 U15.32 U16.2 U16.4 U16.6 U16.8 U16.10 U16.12 U16.14 U16.16 U16.18 U16.19 U16.20 U16.31 U16.32 U19.4(V-) X1.2(GND) X1.4(GND) X2.2(GND) X2.4(GND)
CAN1_H: P4.2 U17.1
CAN1_L: P4.4 R48.1
CAN2_H: P4.1 U17.2
CAN2_L: P4.3 R49.1
D_1.8V: C50.1 C51.1 C53.1 C54.1 C55.1 C56.1 U12.4(V1P8V1) U12.5(VCC1) U12.11(V1P8V1) U15.9 U15.10
D_3.3V: C58.2 C59.2 U12.1(VBUS1) U12.2(V3P3V1) U12.13(CDPENZ1) U15.7 U15.8
D_USB_DM: R44.2 R46.1 U12.7(UD-) U14.2(HSD1+)
D_USB_DP: R45.2 R47.1 U12.8(UD+) U14.8(HSD1-)
HUB1_USB_DM: U10.3(DM3) U16.11
HUB1_USB_DP: U10.4(DP3) U16.13
HUB_USB_DM: R46.2 U10.10(DMU) U14.4(D+)
HUB_USB_DP: R47.2 U10.11(DPU) U14.6(D-)
J_3.3V: P1.13 SW1.3 SW1.6 U15.13 U15.14
J_5V: P1.15 SW1.4 SW1.5 U15.11 U15.12
J_5V_OUT: P2.20 P6.19
J_LED_GREEN: P1.7 U15.29 U15.30
J_LED_RED: P1.5 U15.27 U15.28
J_NC: P2.1 P6.2
J_RTCK: P2.12 P6.11
J_RXD: P2.18 P6.17
J_SRST: P2.16 P6.15
J_TCK: P2.10 P6.9
J_TDI: P2.6 P6.5
J_TDO: P2.14 P6.13
J_TMS: P2.8 P6.7
J_TRST: P2.4 P6.3
J_USB_DM: P1.1 U10.7(DM1)
J_USB_DP: P1.3 U10.8(DP1)
J_VOUT: R1.2 SW1.2 SW1.7 U1.5(IN)
J_VREF: P2.2 P6.1 U1.1(OUT)
O_3.3V: C8.2 C12.2 C13.2 C18.2 C23.2 C24.2 C25.2 C26.2 C27.2 C28.2 D1.3(A) D1.4(A) P3.1 R3.2 U2.6(VIO_B00) U2.16(VPMC) U2.29(VIO_B01) U2.31(VREFH) U2.32(VANA) U2.34(VIO_B00) U4.1(VCCA) U5.1(VCCA) U6.1(VCCA) U7.1(VCCA) U8.1(VCCA) U9.1(VCCA) U16.25 U16.26
O_5V: C6.1 U16.27 U16.28 U19.8(V+)
O_ADC_VREF: C7.2 R52.2 U2.27(PB08/TMR0.COMP1/URT2.TXD/I2C2.SCL/SPI2.CS2/ACMP.COMP0/USB0.ID/ADC0.IN11/CMP0.INN6/CMP1.INN6)
O_JTAG_TCK: P3.4 U2.47(PA06/TMR0.CAPT0/URT1.RXD/I2C1.SDA/SPI0.MISO/TRGM0.P06/JTAG.TCK)
O_JTAG_TDI: P3.6 U2.48(PA05/TMR1.COMP2/URT1.DE/URT1.RTS/SPI0.SCLK/TRGM0.P05/JTAG.TDI)
O_JTAG_TDO: P3.7 U2.1(PA04/URT1.CTS/SPI0.CS0/TRGM0.P04/JTAG.TDO)
O_JTAG_TMS: P3.3 U2.46(PA07/TMR0.COMP0/URT1.TXD/I2C1.SCL/SPI0.MOSI/TRGM0.P07/JTAG.TMS)
O_LED_GREEN: R8.1 U2.2(PA08/TMR0.COMP1/URT2.TXD/I2C2.SCL/SPI3.CS2/JTAG.TRST) U15.25 U15.26
O_LED_RED: R7.1 U2.3(PA09/TMR0.CAPT1/URT2.RXD/I2C2.SDA/SPI3.CS1) U15.23 U15.24
O_MCU_PWR: R15.2 U2.12(PA00/TMR1.COMP0/URT0.TXD/TRGM0.P00) U3.4(EN)
O_MCU_SRST_IN: R22.1 U2.19(PY00/URT0.TXD/USB0.ID/PMIC_PY00/PURT.TXD/PTMR.COMP0/SOC.GPIO_Y00)
O_MCU_SRST_OUT: Q1.1(G) R23.1 U2.37(PA31/SPI1.DAT3/XPI0.CA_CS0/TRGM0.P07/USB0.ID)
O_MCU_TCK: R18.1 U2.24(PB11/URT2.CTS/SPI2.SCLK/ACMP.COMP1/ADC0.IN3/CMP0.INN4/CMP1.INN4) U2.41(PA27/SPI1.SCLK/XPI0.CA_SCLK/TRGM0.P03)
O_MCU_TDI: R19.1 U2.20(PB15/TMR0.COMP3/URT3.TXD/SPI2.DAT3/TRGM0.P03/ADC0.IN7/CMP0.INP1/CMP1.INP1) U2.22(PB13/TMR1.COMP3/URT3.DE/URT3.RTS/I2C3.SCL/SPI2.MOSI/TRGM0.P01/ADC0.IN5/CMP0.INP2/CMP1.INP2)
O_MCU_TDO: R20.1 U2.21(PB14/URT3.RXD/SPI2.DAT2/TRGM0.P02/ADC0.IN6/CMP0.INN1/CMP1.INN1) U2.23(PB12/URT3.CTS/I2C3.SDA/SPI2.MISO/TRGM0.P00/ADC0.IN4/CMP0.INN2/CMP1.INN2)
O_MCU_TMS: R17.1 U2.39(PA29/I2C3.SCL/SPI1.MOSI/XPI0.CA_D2/TRGM0.P05/USB0.OC) U2.40(PA28/I2C3.SDA/SPI1.MISO/XPI0.CA_D0/TRGM0.P04)
O_MCU_TRST: R21.1 U2.8(PA02/TMR1.COMP1/URT0.DE/URT0.RTS/I2C0.SCL/ACMP.COMP0/TRGM0.P02/ACMP.COMP1)
O_RST: C1.2 P3.5 R3.1 U2.13(RESETN)
O_SPI_CS: U2.25(PB10/TMR0.COMP2/URT2.DE/URT2.RTS/SPI2.CS0/ACMP.COMP0/USB0.PWR/ADC0.IN2/CMP0.INP4/CMP1.INP4) U2.42(PA26/SPI1.CS0/XPI0.CA_D3/TRGM0.P02)
O_SRST: R24.2 R25.2 R31.2
O_SRST_DIR: U2.26(PB09/TMR0.CAPT1/URT2.RXD/I2C2.SDA/SPI2.CS1/ACMP.COMP1/USB0.OC/ADC0.IN1/CMP0.INP6/CMP1.INP6) U9.5(DIR)
O_TCK: R27.2 R33.2
O_TCK_DIR: U2.18(PY01/URT0.RXD/WDG0.RST/USB0.OC/PMIC_PY01/PURT.RXD/PTMR.COMP1/SOC.GPIO_Y01) U5.5(DIR)
O_TDI: R28.2 R34.2
O_TDI_DIR: U2.7(PA03/TMR1.CAPT1/URT0.CTS/I2C0.SDA/SPI3.CS3/ACMP.COMP1/TRGM0.P03/ADC0.DBG) U6.5(DIR)
O_TDO: R29.2 R35.2
O_TMS: R26.2 R32.2
O_TMS_DIR: U2.38(PA30/SPI1.DAT2/XPI0.CA_D1/TRGM0.P06/USB0.PWR) U4.5(DIR)
O_TRST: R30.2 R36.2
O_TRST_DIR: U2.11(PA01/TMR1.CAPT0/URT0.RXD/TRGM0.P01/ACMP.COMP0) U8.5(DIR)
O_USB_DM: U2.43(PA25/I2C2.SDA/SPI1.CS1/XPI0.CA_DQS/TRGM0.P01) U10.5(DM2)
O_USB_DP: U2.44(PA24/I2C2.SCL/SPI1.CS2/XPI0.CA_CS1/TRGM0.P00) U10.6(DP2)
O_VDD_SOC: C11.2 C16.2 C17.2 C19.2 C20.2 C21.2 C22.2 L1.2 U2.5(VDD_SOC) U2.9(VDD_SOC) U2.28(VDD_SOC) U2.33(VDD_SOC) U2.45(VDD_SOC)
O_VIO: C3.2 C29.2 C30.2 C31.2 C32.2 C33.2 C34.2 R9.1 R11.1 R12.1 R24.1 U4.6(VCCB) U5.6(VCCB) U6.6(VCCB) U7.6(VCCB) U8.6(VCCB) U9.6(VCCB)
O_VOUT: U3.5(IN) U16.29 U16.30
O_VREF: R13.1 U3.1(OUT)
O_VREF_PWM: R4.1 R5.1 U2.4(PA10/TMR0.COMP2/URT2.DE/URT2.RTS/SPI3.CS0/ACMP.COMP0) U15.21 U15.22
O_XIN: C4.2 U2.35(XTALI) X1.1
O_XOUT: C5.2 U2.36(XTALO) X1.3
R_USB_DM: U10.1(DM4) U16.7
R_USB_DP: U10.2(DP4) U16.9
RS485_A1: P4.8 U18.1
RS485_A2: P4.7 U18.2
RS485_B1: P4.10 R50.1
RS485_B2: P4.9 R51.1
SOC_USB_DM: U14.3(HSD2+) U16.3
SOC_USB_DP: U14.7(HSD2-) U16.1
U_1.8V: C39.2 C40.2 C43.1 C44.1 C46.1 C47.1 C48.1 C49.1 L2.2 R39.2 U12.18(V1P8V2) U12.24(VCC2) U12.25(V1P8V2)
U_3.3V: C42.2 U12.16(CDPENZ2) U12.27(V3P3V2)
U_5V: B1.2 C38.2 C41.2 U11.1(EN) U11.4(VIN) U12.28(VBUS2)
U_GND: C37.1 C38.1 C40.1 C41.1 C42.1 C43.2 C44.2 C45.1 C46.2 C47.2 C48.2 C49.2 D3.2(GND) R37.1 R38.1 R40.1 R43.1 U11.2(GND) U12.17(GND2) U12.19(EQ21) U12.20(EQ20) U12.26(GND2) U13.1(GND) USB1.1(GND) USB1.12(GND)
U_USB_DM: D3.1(I/O1) D3.6(I/O1) R44.1 U12.22(DD-) USB1.5(DN2) USB1.7(DN1)
U_USB_DP: D3.3(I/O2) D3.4(I/O2) R45.1 U12.21(DD+) USB1.6(DP1) USB1.8(DP2)
U_VBUS: B1.1 C37.2 C45.2 D3.5(VBUS) R42.1 U13.2(Vin) USB1.2(VBUS) USB1.11(VBUS)
USB_SWITCH: R41.1 U14.1(S) U16.5
$2N68073: L2.1 U11.3(SW)
$2N68176: C39.1 R39.1 R40.2 U11.5(FB)
$2N73583: R49.2 U17.3
$2N73588: R48.2 U17.4
$2N82814: R37.2 USB1.10(CC2)
$2N82862: R38.2 USB1.4(CC1)
$2N86419: R51.2 U18.3
$2N86421: R50.2 U18.4
$3N2712: C10.2 C15.2 U2.10(VDD_OTPCAP)
$3N3280: L1.1 U2.15(DCDC_LP)
$3N8964: R26.1 U4.4(B)
$3N8968: R17.2 U4.3(A)
$3N9272: R27.1 U5.4(B)
$3N9276: R18.2 U5.3(A)
$3N9580: R19.2 U6.3(A)
$3N9584: R28.1 U6.4(B)
$3N9863: R29.1 U7.4(B)
$3N10368: R21.2 U8.3(A)
$3N10370: R30.1 U8.4(B)
$3N15287: Q1.3(D) R25.1
$3N15535: R20.2 U7.3(A)
$3N15658: R16.2 U3.3(ISET)
$3N17768: D1.2(K) R8.2
$3N17773: D1.1(K) R7.2
$3N17799: C9.2 C14.2 U2.17(VDD_PMCCAP)
$3N32383: R22.2 U9.3(A)
$3N32384: R31.1 U9.4(B)
$3N34404: C2.2 R5.2 R6.1 U19.5(+INB)
$3N34406: R9.2 R10.1 U19.6(-INB)
$3N34408: D2.1(K) R11.2
$3N34409: D2.2(A) U19.7(OUTB)
$3N37219: R13.2 R14.1 U19.3(+INA)
$3N61637: R52.1 U19.1(OUTA) U19.2(-INA)
$4N2763: R2.2 U1.3(ISET)
$4N2764: R1.1 U1.4(EN)
$5N259: U10.15(XO) X2.3
$5N263: U10.16(XI) X2.1

Not connected (* = marked no-connect by the designer): P1 9* 11*; P5 1 2 3 4 5 6 7 8; SW1 1 8 9* 10* 11* 12*; U2 14(WAKEUP)*; U10 9(RESET#/CDP)*; U12 6(V2OK)* 14(NC)* 15(NC)* 23(V1OK)*; U13 3(NC)* 5(NC)* 8(NC)*; U15 15* 16* 17* 18* 19* 20*; U16 15* 17* 21* 22* 23* 24*; USB1 3(SBU2)* 9(SBU1)* 13(SHELL)* 16(SHELL)*

## Notes on the sheets
sheet 1
- 电源/USB跳线
- 1.8V电源
- 隔离电源
- 板间连接排针
- OSBDM接口
- Type-C接口
- USB隔离
- X-Link接口
- USB切换开关跳线
- 终端电阻
- USB TVS
- USB切换开关
sheet 2
- 6.8/12K=567mA
- IO电压缓冲
- Vref缓冲
- 输出配电开关
- 电平转换
- SRST开漏输出
- 单片机
- 指示灯
- 晶体
- JTAG接口
sheet 3
- X-Link模块连接排针
- 6.8/12K=567mA
- 电源输出开关
- 电源输出过流保护
